# Altium project HammerHeadBreakout.PrjPCB
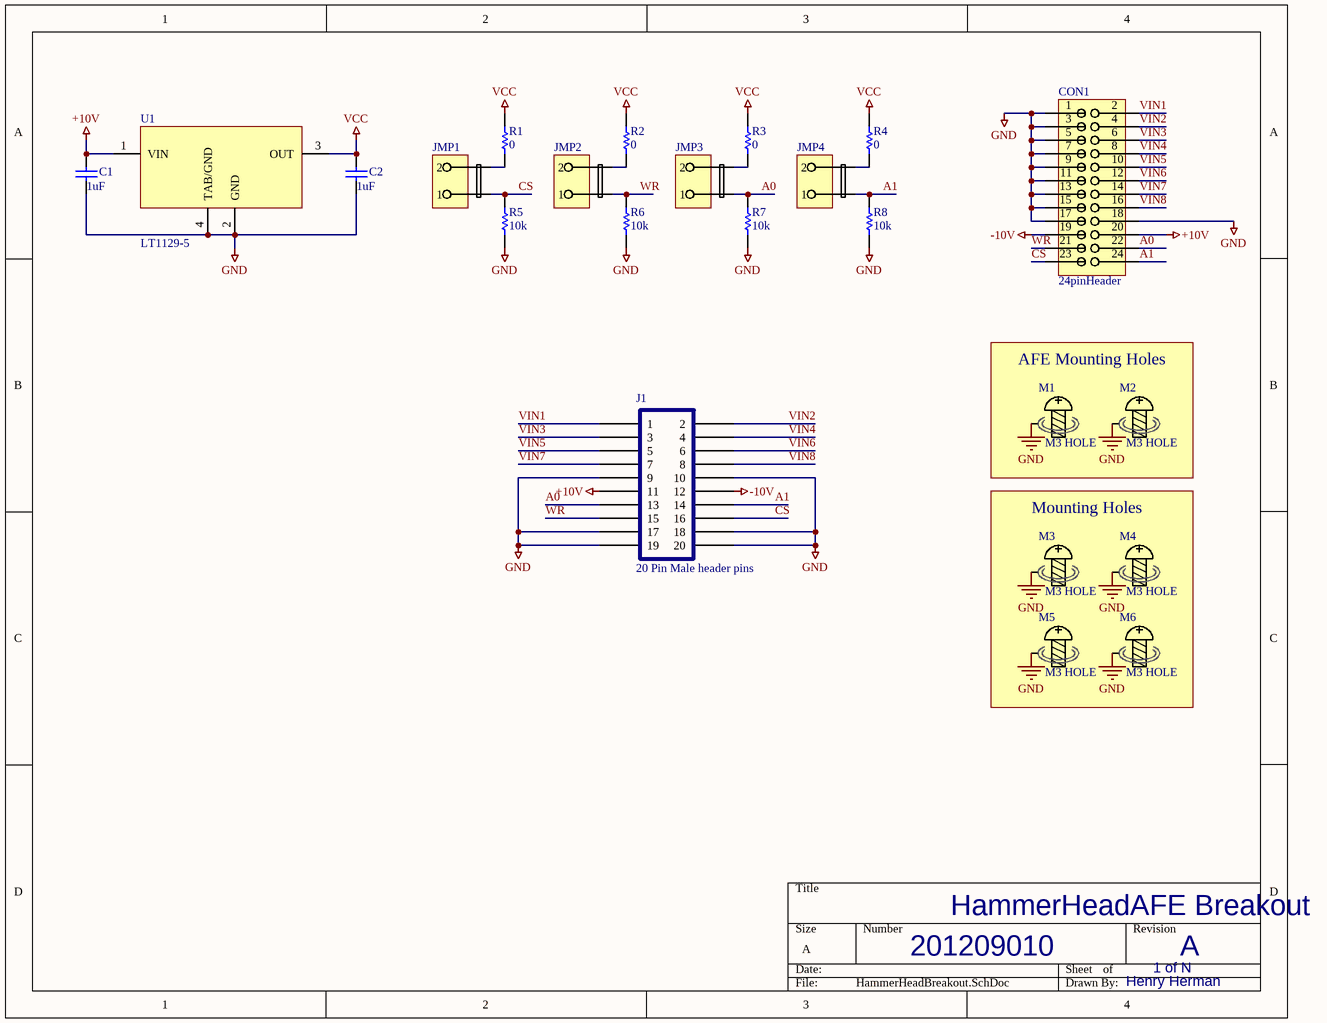
[diagram p0: HammerHeadBreakout.SchDoc]
1 sheet, 23 parts. Net scope: global (net labels, ports and power ports of the same name join across sheets).
Board file: HammerHeadBreakout.PcbDoc

## Sheet HammerHeadBreakout.SchDoc
size A

### Parts
C1  value 1uF  [SM/C_0805]  (hidden comment: CAP)
C2  value 1uF  [SM/C_0805]  (hidden comment: CAP)
CON1  24pinHeader  [CONN-RECEPT-24PIN]
J1  20 Pin Male header pins  [M10x2-Shrouded]
JMP1  JMPR-2PIN-THRU  [M02]  (value not drawn)
JMP2  JMPR-2PIN-THRU  [M02]  (value not drawn)
JMP3  JMPR-2PIN-THRU  [M02]  (value not drawn)
JMP4  JMPR-2PIN-THRU  [M02]  (value not drawn)
M1  M3 HOLE  [MOUNTING_HOLE-125mil]
M2  M3 HOLE  [MOUNTING_HOLE-125mil]
M3  M3 HOLE  [MOUNTING_HOLE-125mil]
M4  M3 HOLE  [MOUNTING_HOLE-125mil]
M5  M3 HOLE  [MOUNTING_HOLE-125mil]
M6  M3 HOLE  [MOUNTING_HOLE-125mil]
R1  value 0  [SM/R_0805]  (hidden comment: Res)
R2  value 0  [SM/R_0805]  (hidden comment: Res)
R3  value 0  [SM/R_0805]  (hidden comment: Res)
R4  value 0  [SM/R_0805]  (hidden comment: Res)
R5  value 10k  [SM/R_0805]  (hidden comment: Res)
R6  value 10k  [SM/R_0805]  (hidden comment: Res)
R7  value 10k  [SM/R_0805]  (hidden comment: Res)
R8  value 10k  [SM/R_0805]  (hidden comment: Res)
U1  LT1129-5  [SOT223-3Lead-STPackage-LinearTechLT1129-3.3]

### Blocks framed on the sheet
AFE Mounting Holes: M1 M2
Mounting Holes: M3-M6

### Nets
+10V: C1.2 CON1.20 J1.11 U1.1(VIN)
-10V: CON1.19 J1.12
GND: C1.1 C2.1 CON1.1 CON1.3 CON1.5 CON1.7 CON1.9 CON1.11 CON1.13 CON1.15 CON1.17 CON1.18 J1.9 J1.10 J1.17 J1.18 J1.19 J1.20 M1.0(PAD) M2.0(PAD) M3.0(PAD) M4.0(PAD) M5.0(PAD) M6.0(PAD) R5.1 R6.1 R7.1 R8.1 U1.2(GND) U1.4(TAB/GND)
VCC: C2.2 R1.2 R2.2 R3.2 R4.2 U1.3(OUT)
A0: CON1.22 J1.13 JMP3.1 R7.2
A1: CON1.24 J1.14 JMP4.1 R8.2
CS: CON1.23 J1.16 JMP1.1 R5.2
VIN1: CON1.2 J1.1
VIN2: CON1.4 J1.2
VIN3: CON1.6 J1.3
VIN4: CON1.8 J1.4
VIN5: CON1.10 J1.5
VIN6: CON1.12 J1.6
VIN7: CON1.14 J1.7
VIN8: CON1.16 J1.8
WR: CON1.21 J1.15 JMP2.1 R6.2
NetJMP1_2: JMP1.2 R1.1
NetJMP2_2: JMP2.2 R2.1
NetJMP3_2: JMP3.2 R3.1
NetJMP4_2: JMP4.2 R4.1

### Notes on the sheet
- 201209010
- HammerHeadAFE Breakout
- 1 of N
- A
- Henry Herman

### Library data of the parts
J1 = M10x2-HeaderPinsConnector: Standard 20 Pin Ribbon Cable Connector
M1-M6 = MountingHole
R1-R8 = Res: Resistor; Published: 8-Jun-2000; LatestRevisionDate: 17-Jul-2002; LatestRevisionNote: Re-released for DXP Platform.; PackageReference: AXIAL-0.3; Publisher: Altium Limited
C1 C2 = CAP: Label: 1uF